# EAGLE schematic controller (EAGLE 7.7.0)
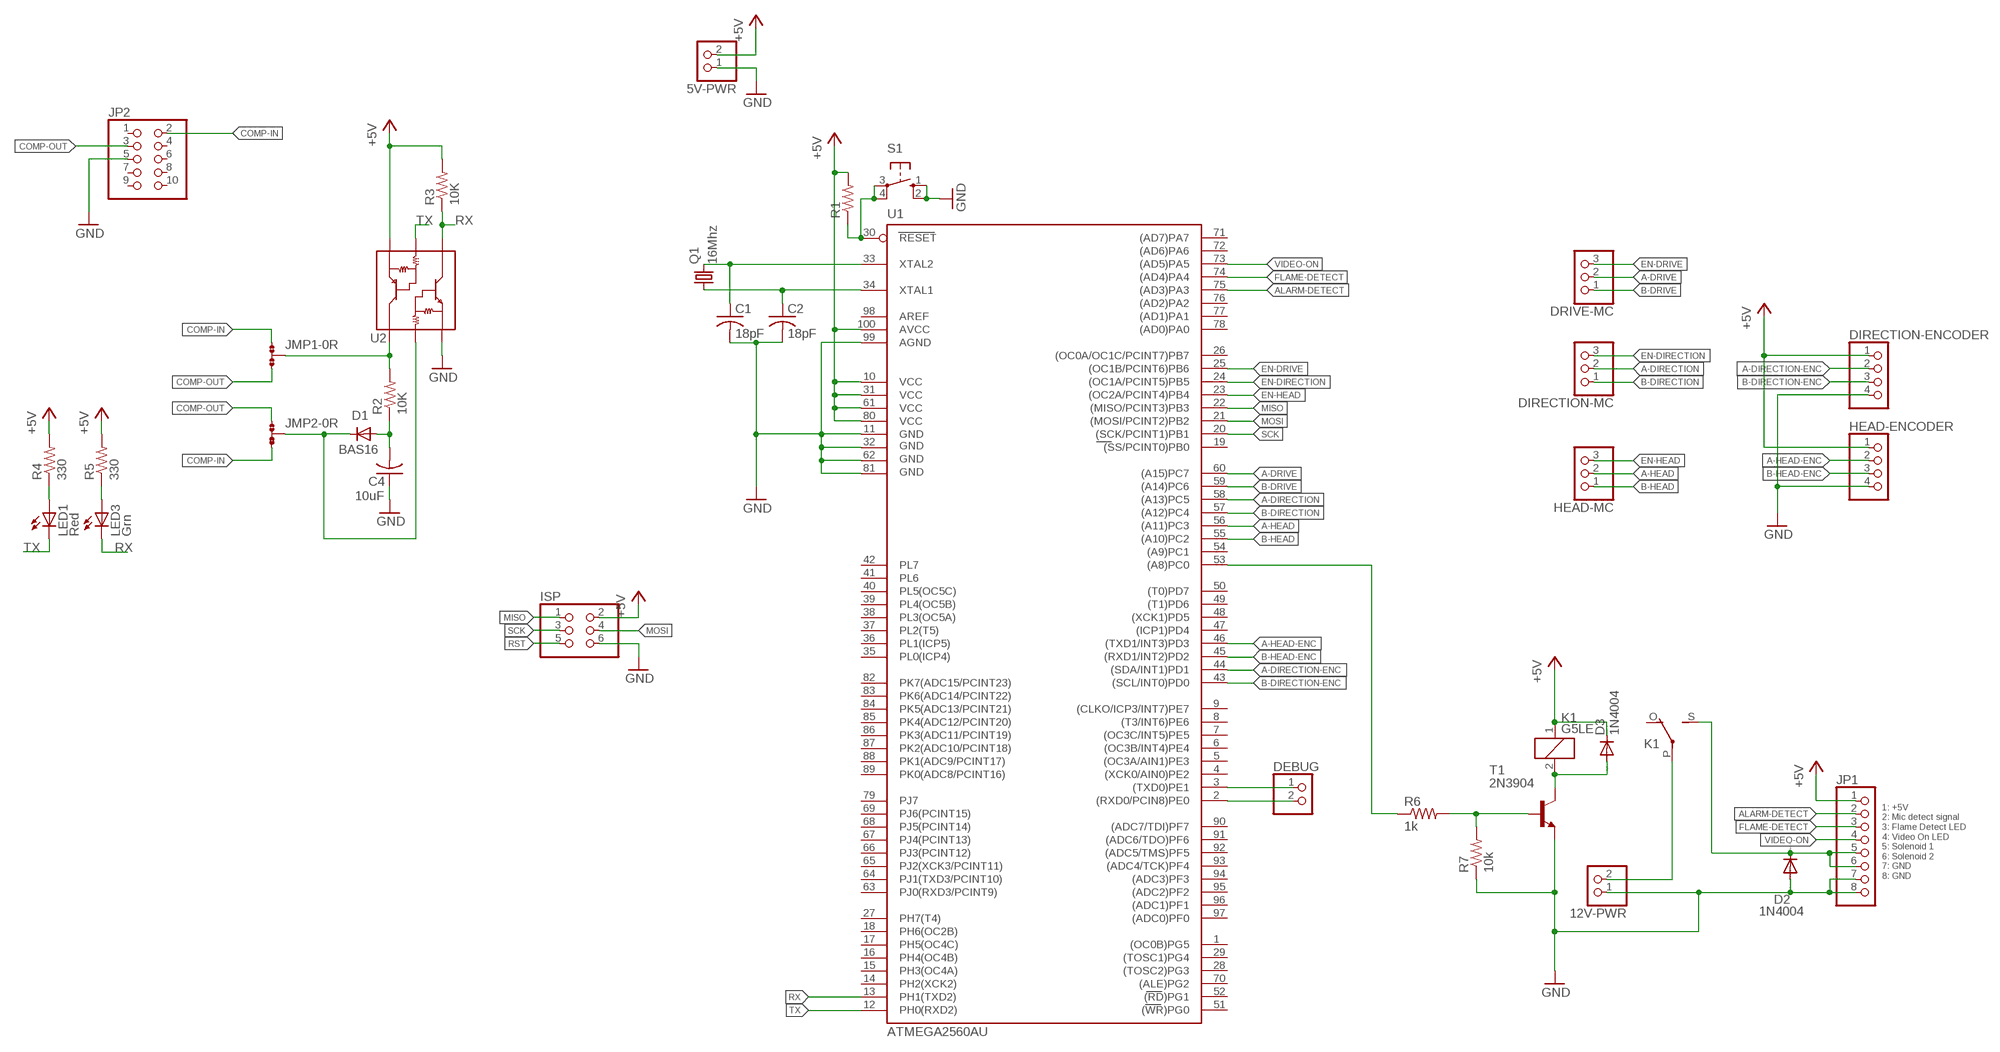
[diagram p0: schematic, sheet 1]

## Parts
5V-PWR  PINHD-1X2  [1X02]
12V-PWR  PINHD-1X2  [1X02]
C1  18pF  C-USC0402K  [C0402K]
C2  18pF  C-USC0402K  [C0402K]
C4  10uF  C-USC0805  [C0805]
D1  BAS16  DIODESOD  [SOD-323]
D2  1N4004  [DO41-10]
D3  1N4004  [DO41-10]
DEBUG  PINHD-1X2  [1X02]
DIRECTION-ENCODER  PINHD-1X4  [1X04]
DIRECTION-MC  PINHD-1X3  [1X03]
DRIVE-MC  PINHD-1X3  [1X03]
HEAD-ENCODER  PINHD-1X4  [1X04]
HEAD-MC  PINHD-1X3  [1X03]
ISP  PINHD-2X3  [2X03]
JMP1  0R-JUMPA  [A0R-JMP]
JMP2  0R-JUMPA  [A0R-JMP]
JP1  PINHD-1X8  [1X08]
JP2  PINHD-2X5  [2X05]
K1  G5LE  [G5LE]
LED1  Red  LED1206  [LED-1206]
LED3  Grn  LED1206  [LED-1206]
Q1  16Mhz  CRYSTALHC49S  [HC49/S]
R1  R-US_M0805  [M0805]
R2  10K  R-US_R0805  [R0805]
R3  10K  R-US_R0805  [R0805]
R4  330  R-US_R0805  [R0805]
R5  330  R-US_R0805  [R0805]
R6  1k  R-US_R0805  [R0805]
R7  10k  R-US_R0805  [R0805]
S1  10-XX  [B3F-10XX]
T1  2N3904  [TO92]
U1  ATMEGA2560AU  [TQFP100]
U2  XN04312  XN04312SOT  [SOT23-6]

## Nets
+5V: 5V-PWR.2 D3.C DIRECTION-ENCODER.1 HEAD-ENCODER.1 ISP.2 JP1.1 K1.1 R1.2 R3.2 R4.2 R5.2 U1.10(VCC) U1.31(VCC1) U1.61(VCC2) U1.80(VCC3) U1.100(AVCC) U2.3(E2)
A-DIRECTION: DIRECTION-MC.2 U1.58((A13)PC5)
A-DIRECTION-ENC: DIRECTION-ENCODER.2 U1.44((SDA/INT1)PD1)
A-DRIVE: DRIVE-MC.2 U1.60((A15)PC7)
A-HEAD: HEAD-MC.2 U1.56((A11)PC3)
A-HEAD-ENC: HEAD-ENCODER.2 U1.46((TXD1/INT3)PD3)
ALARM-DETECT: JP1.2 U1.75((AD3)PA3)
B-DIRECTION: DIRECTION-MC.1 U1.57((A12)PC4)
B-DIRECTION-ENC: DIRECTION-ENCODER.3 U1.43((SCL/INT0)PD0)
B-DRIVE: DRIVE-MC.1 U1.59((A14)PC6)
B-HEAD: HEAD-MC.1 U1.55((A10)PC2)
B-HEAD-ENC: HEAD-ENCODER.3 U1.45((RXD1/INT2)PD2)
COMP-IN: JMP1.1 JMP2.3 JP2.2
COMP-OUT: JMP1.3 JMP2.1 JP2.3
EN-DIRECTION: DIRECTION-MC.3 U1.24((OC1A/PCINT5)PB5)
EN-DRIVE: DRIVE-MC.3 U1.25((OC1B/PCINT6)PB6)
EN-HEAD: HEAD-MC.3 U1.23((OC2A/PCINT4)PB4)
FLAME-DETECT: JP1.3 U1.74((AD4)PA4)
GND: 5V-PWR.1 12V-PWR.1 C1.2 C2.2 C4.1 D2.A DIRECTION-ENCODER.4 HEAD-ENCODER.4 ISP.6 JP1.7 JP1.8 JP2.5 R7.1 S1.1(S) S1.2(S1) T1.3(E) U1.11(GND) U1.32(GND1) U1.62(GND2) U1.81(GND3) U1.99(AGND) U2.6(E1)
MISO: ISP.1 U1.22((MISO/PCINT3)PB3)
MOSI: ISP.4 U1.21((MOSI/PCINT2)PB2)
N$1: C1.1 Q1.2 U1.33(XTAL2)
N$2: C2.1 Q1.1 U1.34(XTAL1)
N$3: DEBUG.1 U1.3((TXD0)PE1)
N$4: C4.2 D1.2(A) R2.1
N$5: LED1.A R4.1
N$6: LED3.A R5.1
N$7: 12V-PWR.2 K1.P(2:P)
N$8: DEBUG.2 U1.2((RXD0/PCIN8)PE0)
N$9: D2.C JP1.5 JP1.6 K1.S(2:S)
N$10: D3.A K1.2 T1.1(C)
N$11: R6.2 R7.2 T1.2(B)
N$13: R6.1 U1.53((A8)PC0)
N$22: JMP1.2 R2.2 U2.4(C2)
N$23: D1.1(C) JMP2.2 U2.5(B1)
RST: ISP.5 R1.1 S1.3(P) S1.4(P1) U1.30(RESET)
RX: LED3.C R3.1 U1.13(PH1(TXD2)) U2.1(C1)
SCK: ISP.3 U1.20((SCK/PCINT1)PB1)
TX: LED1.C U1.12(PH0(RXD2)) U2.2(B2)
VIDEO-ON: JP1.4 U1.73((AD5)PA5)
Unconnected: JP2.1 JP2.4 JP2.6 JP2.7 JP2.8 JP2.9 JP2.10 K1.O(2:O) U1.1((OC0B)PG5) U1.4((XCK0/AIN0)PE2) U1.5((OC3A/AIN1)PE3) U1.6((OC3B/INT4)PE4) U1.7((OC3C/INT5)PE5) U1.8((T3/INT6)PE6) U1.9((CLKO/ICP3/INT7)PE7) U1.14(PH2(XCK2)) U1.15(PH3(OC4A)) U1.16(PH4(OC4B)) U1.17(PH5(OC4C)) U1.18(PH6(OC2B)) U1.19((SS/PCINT0)PB0) U1.26((OC0A/OC1C/PCINT7)PB7) U1.27(PH7(T4)) U1.28((TOSC2)PG3) U1.29((TOSC1)PG4) U1.35(PL0(ICP4)) U1.36(PL1(ICP5)) U1.37(PL2(T5)) U1.38(PL3(OC5A)) U1.39(PL4(OC5B)) U1.40(PL5(OC5C)) U1.41(PL6) U1.42(PL7) U1.47((ICP1)PD4) U1.48((XCK1)PD5) U1.49((T1)PD6) U1.50((T0)PD7) U1.51((WR)PG0) U1.52((RD)PG1) U1.54((A9)PC1) U1.63(PJ0(RXD3/PCINT9)) U1.64(PJ1(TXD3/PCINT10)) U1.65(PJ2(XCK3/PCINT11)) U1.66(PJ3(PCINT12)) U1.67(PJ4(PCINT13)) U1.68(PJ5(PCINT14)) U1.69(PJ6(PCINT15)) U1.70((ALE)PG2) U1.71((AD7)PA7) U1.72((AD6)PA6) U1.76((AD2)PA2) U1.77((AD1)PA1) U1.78((AD0)PA0) U1.79(PJ7) U1.82(PK7(ADC15/PCINT23)) U1.83(PK6(ADC14/PCINT22)) U1.84(PK5(ADC13/PCINT21)) U1.85(PK4(ADC12/PCINT20)) U1.86(PK3(ADC11/PCINT19)) U1.87(PK2(ADC10/PCINT18)) U1.88(PK1(ADC9/PCINT17)) U1.89(PK0(ADC8/PCINT16)) U1.90((ADC7/TDI)PF7) U1.91((ADC6/TDO)PF6) U1.92((ADC5/TMS)PF5) U1.93((ADC4/TCK)PF4) U1.94((ADC3)PF3) U1.95((ADC2)PF2) U1.96((ADC1)PF1) U1.97((ADC0)PF0) U1.98(AREF)

## Notes on the sheet
- 1: +5V
  2: Mic detect signal
  3: Flame Detect LED
  4: Video On LED
  5: Solenoid 1
  6: Solenoid 2
  7: GND
  8: GND

## Library data of the parts
5V-PWR 12V-PWR DEBUG = pinhead:PINHD-1X2: PIN HEADER
C1 C2 = rcl:C-US: CAPACITOR, American symbol
C4 = resistor:C-US: CAPACITOR, American symbol
D1 = SparkFun:DIODE: Diode These are standard reverse protection diodes and small signal diodes. SMA package can handle up to about 1A. SOD-323 can handle about 200mA. What the SOD-323 package when ordering, there are some mfgs out there that are 5-pin packages.
D2 D3 = diode:1N4004: DIODE general purpose rectifier, 1 A
DIRECTION-ENCODER HEAD-ENCODER = pinhead:PINHD-1X4: PIN HEADER
DIRECTION-MC DRIVE-MC HEAD-MC = pinhead:PINHD-1X3: PIN HEADER
ISP = pinhead:PINHD-2X3: PIN HEADER
JMP1 JMP2 = jump-0r-smd:0R-JUMP: SMD 0R 0805 Jumper
JP1 = pinhead:PINHD-1X8: PIN HEADER
JP2 = pinhead:PINHD-2X5: PIN HEADER
K1 = relay:G5LE: RELAY 1 x switch, 10 A/120 V AC, 8 A/30 V DC, Omron; OC_FARNELL: unknown; OC_NEWARK: unknown
LED1 LED3 = SparkFun:LED: LEDs Standard schematic elements and footprints for 5mm, 3mm, 1206, and 0603 sized LEDs. 5mm - Spark Fun Electronics SKU : COM-00529 (and others)
Q1 = crystal:CRYSTAL: CRYSTAL; OC_FARNELL: 1667008; OC_NEWARK: unknown
R1 R6 R7 = rcl:R-US_: RESISTOR, American symbol
R2-R5 = resistor:R-US_: RESISTOR, American symbol
S1 = switch-omron:10-XX: OMRON SWITCH; MPN: B3F-1000; OC_FARNELL: 176432; OC_NEWARK: 36M3542
T1 = transistor:2N3904: NPN TRANSISTOR
U1 = SparkFun-IC-Microcontroller:ATMEGA2560: Atmel 100-pin 8-bit uC 64/128/256 Kbytes FLASH 4 Kbytes EEPROM 8 Kbytes SRAM 86 General Purpose I/O pins 12-channels16-bit PWM 4 x Serial USARTs 16-channels 10-bit A/D SparkFun Products None.; PROD_ID: IC-10040
U2 = SparkFun:XN04312: NPN/PNP Transistor Array Handy dandy transistor array for level shifting and inverting signals. Spark Fun Electronics SKU : COM-00588